# Altium schematic sheet High Current H-Bridge.SchDoc: High Current H-Bridge
size Letter; Date: 2017-01-26; DocumentNumber: 2; Revision: A; SheetNumber: 2; SheetTotal: 16; DesignedBy: Mike MacKay
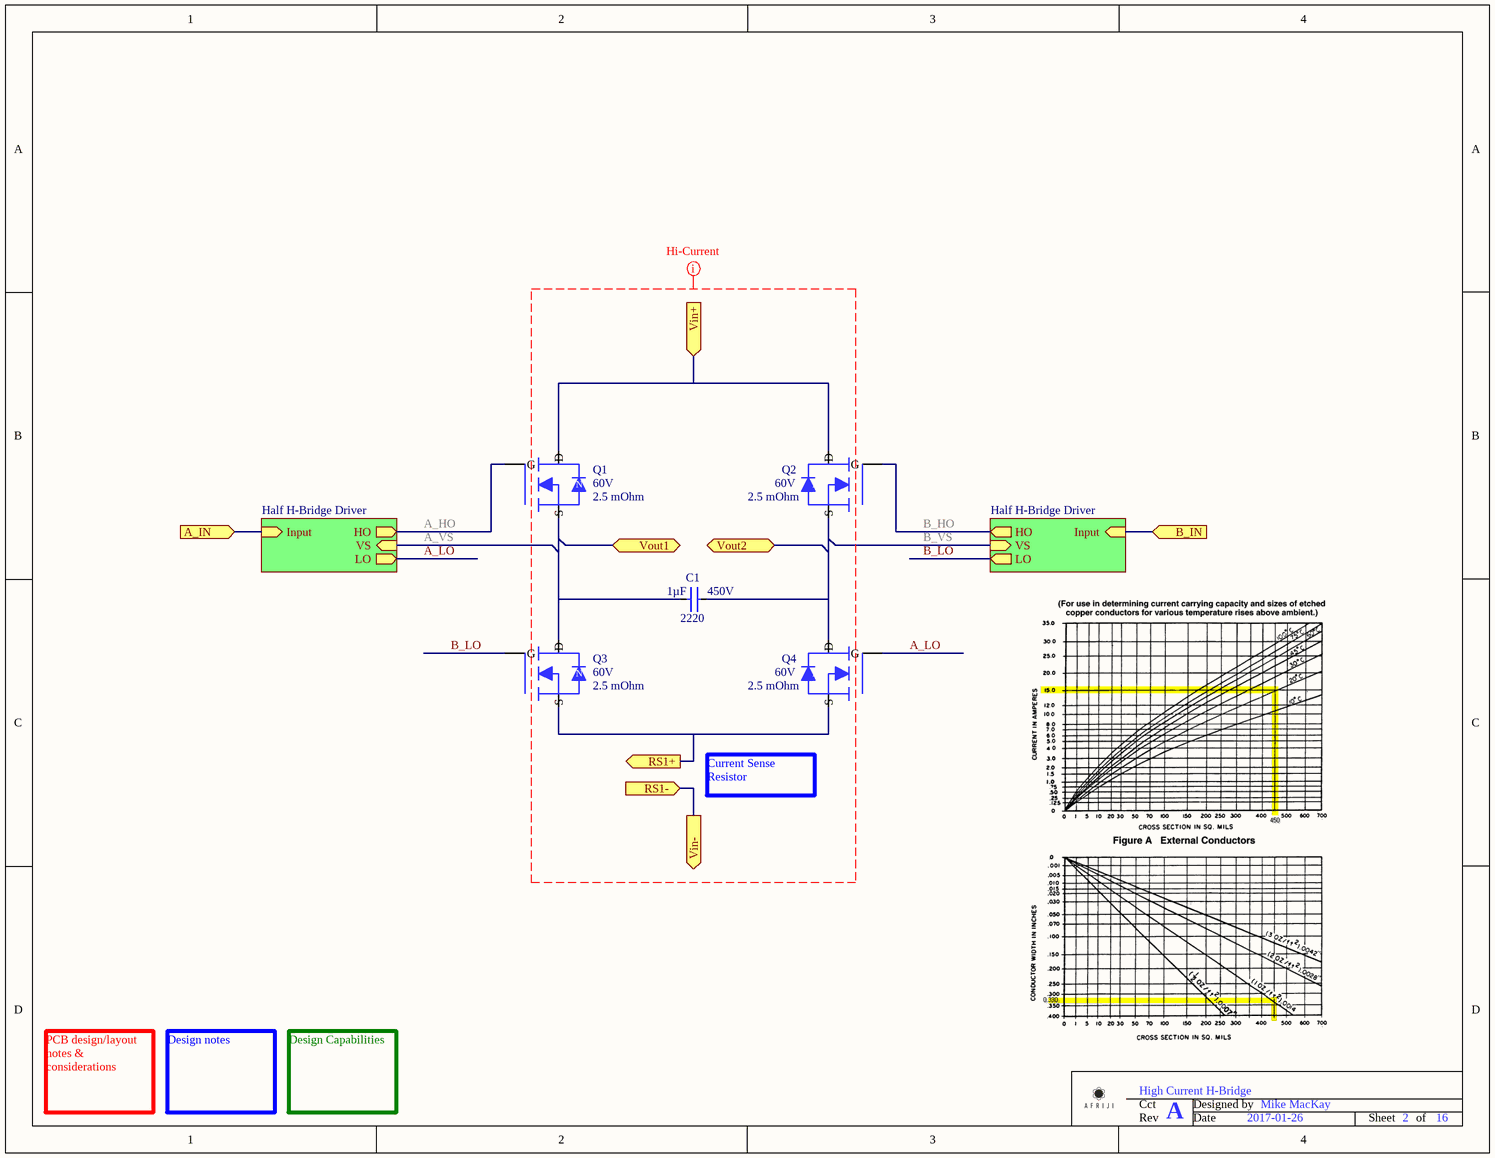
[diagram p0: High Current H-Bridge.SchDoc]

## Parts
C1  Capacitance: 1µF  Voltage - Rated: 450V  Package / Case: 2220  [C2220 - Ceramic]  (hidden comment: 1uF 2220 450V)
Q1  Drain to Source Voltage (Vdss): 60V  Rds On (Max) @ Id, Vgs: 2.5 mOhm  [DPAK]  (hidden comment: N-MOSFET - 66A/25V)
Q2  Drain to Source Voltage (Vdss): 60V  Rds On (Max) @ Id, Vgs: 2.5 mOhm  [DPAK]  (hidden comment: N-MOSFET - 66A/25V)
Q3  Drain to Source Voltage (Vdss): 60V  Rds On (Max) @ Id, Vgs: 2.5 mOhm  [DPAK]  (hidden comment: N-MOSFET - 66A/25V)
Q4  Drain to Source Voltage (Vdss): 60V  Rds On (Max) @ Id, Vgs: 2.5 mOhm  [DPAK]  (hidden comment: N-MOSFET - 66A/25V)

## Sub-sheets
Half H-Bridge Driver = Half H-Bridge Driver.SchDoc: HO (out), VS (in), LO (out), Input (in)
Half H-Bridge Driver = Half H-Bridge Driver.SchDoc: HO (out), VS (in), LO (out), Input (in)

## Ports
A_IN (in), B_IN (in), RS1+ (out), RS1- (in), Vin+ (in), Vin- (out), Vout1 (bidir), Vout2 (bidir)

## Nets
A_HO: Q1.1(G) ; sheet Half H-Bridge Driver/HO
A_IN: port A_IN, sheet Half H-Bridge Driver/Input
A_LO: Q4.1(G) ; sheet Half H-Bridge Driver/LO
A_VS: C1.1 Q1.2(S) Q3.3(D) ; port Vout1, sheet Half H-Bridge Driver/VS
B_HO: Q2.1(G) ; sheet Half H-Bridge Driver/HO
B_IN: port B_IN, sheet Half H-Bridge Driver/Input
B_LO: Q3.1(G) ; sheet Half H-Bridge Driver/LO
B_VS: C1.2 Q2.2(S) Q4.3(D) ; port Vout2, sheet Half H-Bridge Driver/VS
RS1+: Q3.2(S) Q4.2(S) ; port RS1+
RS1-: port Vin-, port RS1-
Vin+: Q1.3(D) Q2.3(D) ; port Vin+

## Layout directives
net class 15A: (no net found under the mark)

## Notes on the sheet
- Current Sense Resistor
- PCB design/layout notes & considerations
- Design notes
- Design Capabilities
- Cct
- Designed by
- Rev
- Date
- Sheet
- of
- (in symbol N-MOSFET - 66A/25V) N

## Library data of the parts
C1 = 1uF 2220 450V: Manufacturer: TDK Corporation; Manufacturer Part Number: CGA9P4X7T2W105M250KE; Tolerance: ±20%; Temperature Coefficient: X7T; Supplier 1: Digi-Key; Supplier Part Number 1: 445-7998-1-ND; RoHS: RoHS Compliant; Category: Capacitors; Stock 1: 10247; Pricing 1: 1=3.11, 10=2.576, 100=2.1589, 250=1.78012 (USD); Packaging: Cut Tape (CT); Part Status: Active; Operating Temperature: -55°C ~ 125°C; Features: Soft Termination; Ratings: AEC-Q200; Applications: Automotive, Boardflex Sensitive; Failure Rate: -; Mounting Type: Surface Mount, MLCC; Size / Dimension: 0.224" L x 0.197" W (5.70mm x 5.00mm); Height - Seated (Max): -; Thickness (Max): 0.098" (2.50mm); Lead Spacing: -; Lead Style: -; ComponentLink1URL: https://product.tdk.com/info/en/catalog/datasheets/mlcc_automotive_soft_en.pdf; ComponentLink1Description: Spec Sheet; Value: 1uF 2220 450V
Q1-Q4 = N-MOSFET - 66A/25V: Manufacturer: Infineon Technologies; Manufacturer Part Number: IPD025N06N; FET Type: N-Channel; Current - Continuous Drain (Id) @ 25°C: 90A; Drive Voltage (Max Rds On,  Min Rds On): 6V, 10V; Vgs(th) (Max) @ Id: 2.8V @ 95µA; Gate Charge (Qg) (Max) @ Vgs: 71nC @ 10V; Input Capacitance (Ciss) (Max) @ Vds: 5200pF @ 30V; Vgs (Max): ±20V; Power Dissipation (Max): 3W (Ta), 167W (Tc); Supplier 1: Digi-Key; Supplier Part Number 1: IPD025N06NCT-ND; RoHS: RoHS Compliant; Category: Discrete Semiconductor Products; Stock 1: 5405; Pricing 1: 1=1.91, 10=1.72, 100=1.3822, 500=1.13558, 1000=0.94091 (USD); Packaging: Cut Tape (CT); Part Status: Active; Technology: MOSFET (Metal Oxide); FET Feature: -; Operating Temperature: -55°C ~ 175°C (TJ); Mounting Type: Surface Mount; Supplier Device Package: PG-TO252-3; Package / Case: TO-252-3, DPak (2 Leads + Tab), SC-63; ComponentLink1URL: http://www.infineon.com/dgdl/IPD025N06N_Rev2+1.pdf?folderId=db3a304313b8b5a60113cee8763b02d7&fileId=db3a304336415dec0136531648062c76; ComponentLink1Description: Spec Sheet